# Altium schematic sheet 主控系统板2.SchDoc
size A4
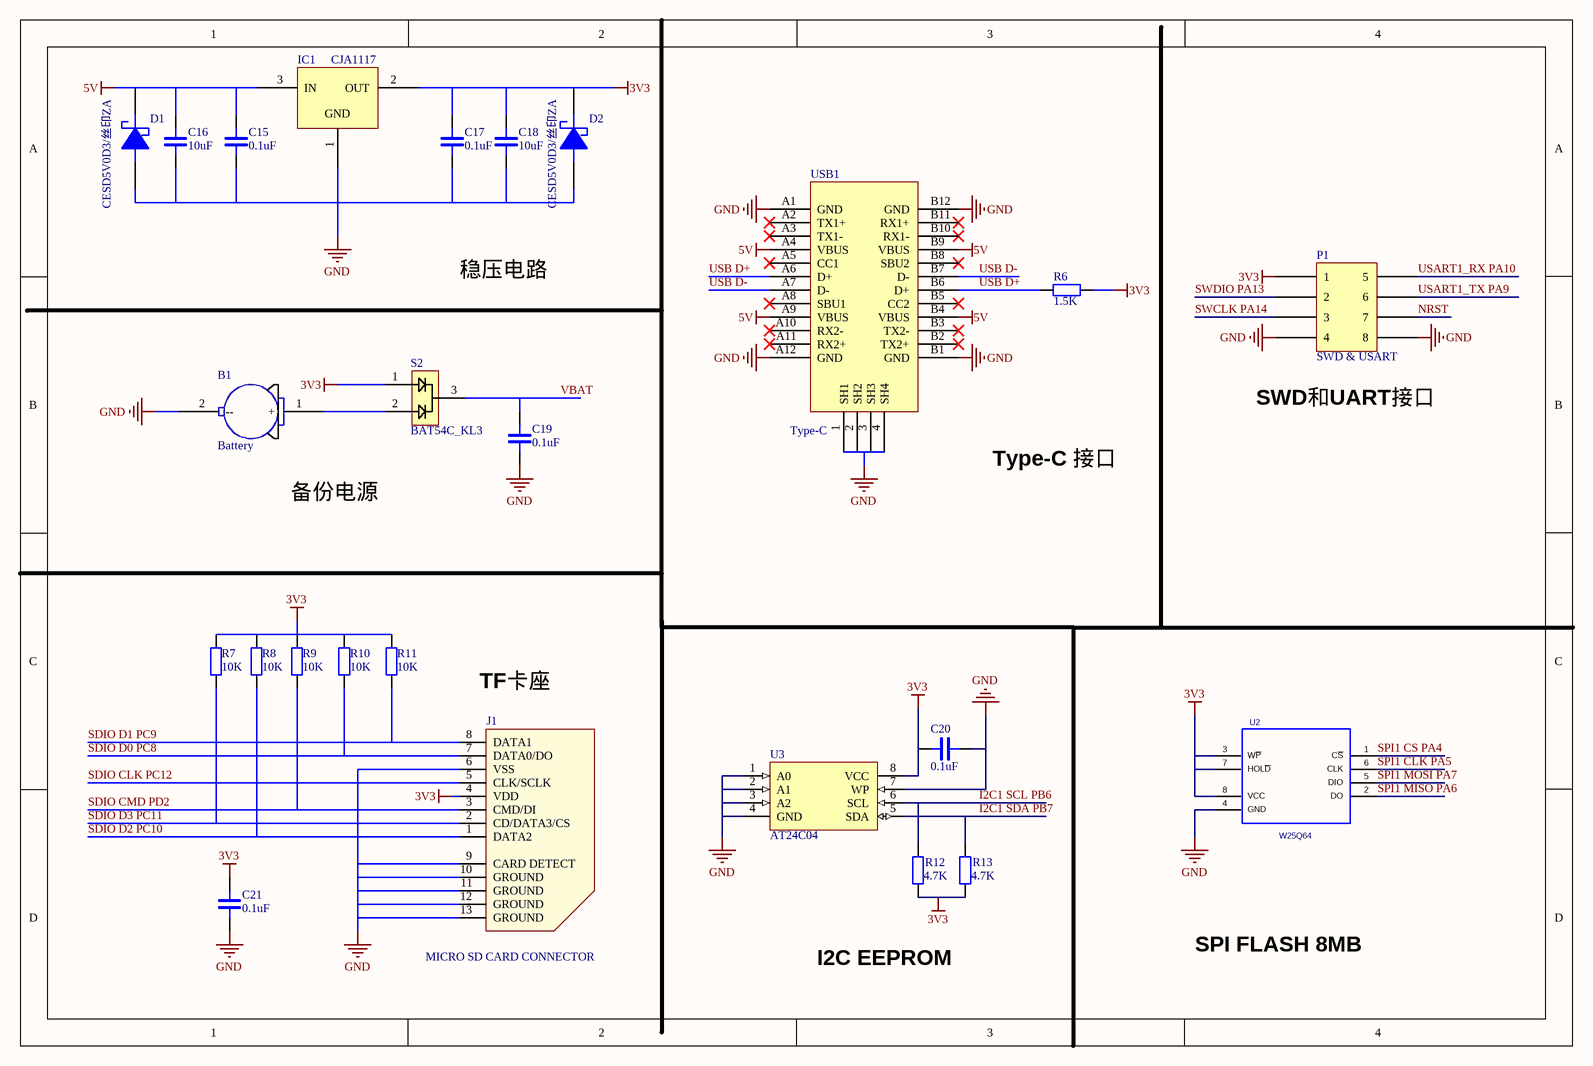
[diagram p0: 主控系统板2.SchDoc]

## Parts
B1  Battery  [CR1220]
C15  0.1uF  [0603]
C16  10uF  [0603]
C17  0.1uF  [0603]
C18  10uF  [0603]
C19  0.1uF  [0603]
C20  0.1uF  [0603]
C21  0.1uF  [0603]
D1  CESD5V0D3/丝印ZA  [SOD323]
D2  CESD5V0D3/丝印ZA  [SOD323]
IC1  CJA1117  [SOT89]
J1  MICRO SD CARD CONNECTOR  [MICRO SD CARD CONNECTOR]
P1  SWD & USART  [2X4P-2.5MM-SMD]
R6  1.5K  [0603]
R7  10K  [0603]
R8  10K  [0603]
R9  10K  [0603]
R10  10K  [0603]
R11  10K  [0603]
R12  4.7K  [0603]
R13  4.7K  [0603]
S2  BAT54C_KL3  [SOT-23]
U2  W25Q64  [SO8WB]
U3  AT24C04  [SO-8]
USB1  Type-C  [Type-C]

## Nets
3V3: C17.1 C18.1 C20.1 C21.1 D2.2(-) IC1.2(OUT) J1.4(VDD) P1.1 R6.1 R7.1 R8.1 R9.1 R10.1 R11.1 R12.2 R13.2 S2.1 U2.3(W~{P}) U2.7(HOL~{D}) U2.8(VCC) U3.8(VCC)
5V: C15.1 C16.1 D1.2(-) IC1.3(IN) USB1.A4(VBUS) USB1.A9(VBUS) USB1.B4(VBUS) USB1.B9(VBUS)
GND: B1.2(--) C15.2 C16.2 C17.2 C18.2 C19.2 C20.2 C21.2 D1.1(+) D2.1(+) IC1.1(GND) J1.6(VSS) J1.9(CARD_DETECT) J1.10(GROUND) J1.11(GROUND) J1.12(GROUND) J1.13(GROUND) P1.4 P1.8 U2.4(GND) U3.1(A0) U3.2(A1) U3.3(A2) U3.4(GND) U3.7(WP) USB1.1(SH1) USB1.2(SH2) USB1.3(SH3) USB1.4(SH4) USB1.A1(GND) USB1.A12(GND) USB1.B1(GND) USB1.B12(GND)
I2C1 SCL PB6: R12.1 U3.6(SCL)
I2C1 SDA PB7: R13.1 U3.5(SDA)
NRST: P1.7
SDIO CLK PC12: J1.5(CLK/SCLK)
SDIO CMD PD2: J1.3(CMD/DI) R9.2
SDIO D0 PC8: J1.7(DATA0/DO) R10.2
SDIO D1 PC9: J1.8(DATA1) R11.2
SDIO D2 PC10: J1.1(DATA2) R8.2
SDIO D3 PC11: J1.2(CD/DATA3/CS) R7.2
SPI1 CLK PA5: U2.6(CLK)
SPI1 CS PA4: U2.1(C~{S})
SPI1 MISO PA6: U2.2(DO)
SPI1 MOSI PA7: U2.5(DIO)
SWCLK PA14: P1.3
SWDIO PA13: P1.2
USART1_RX PA10: P1.5
USART1_TX PA9: P1.6
USB D+: R6.2 USB1.A6(D+) USB1.B6(D+)
USB D-: USB1.A7(D-) USB1.B7(D-)
VBAT: C19.1 S2.3
NetB1_1: B1.1(+) S2.2

Not connected (* = marked no-connect by the designer): USB1 A2(TX1+)* A3(TX1-)* A5(CC1)* A8(SBU1)* A10(RX2-)* A11(RX2+)* B2(TX2+)* B3(TX2-)* B5(CC2)* B8(SBU2)* B10(RX1-)* B11(RX1+)*

## Notes on the sheet
- 稳压电路
- (near P1) SWD和UART接口
- 备份电源
- Type-C 接口
- (near J1) TF卡座
- I2C EEPROM
- SPI FLASH 8MB

## Library data of the parts
C15-C21 = CAP: Capacitor
D1 D2 = TVS
P1 = CON4-X2
R6-R13 = RES: Resistor
U3 = AT24Cxx: EEPROM
U2 = W25Q64: PCB DECAL: SO8WB